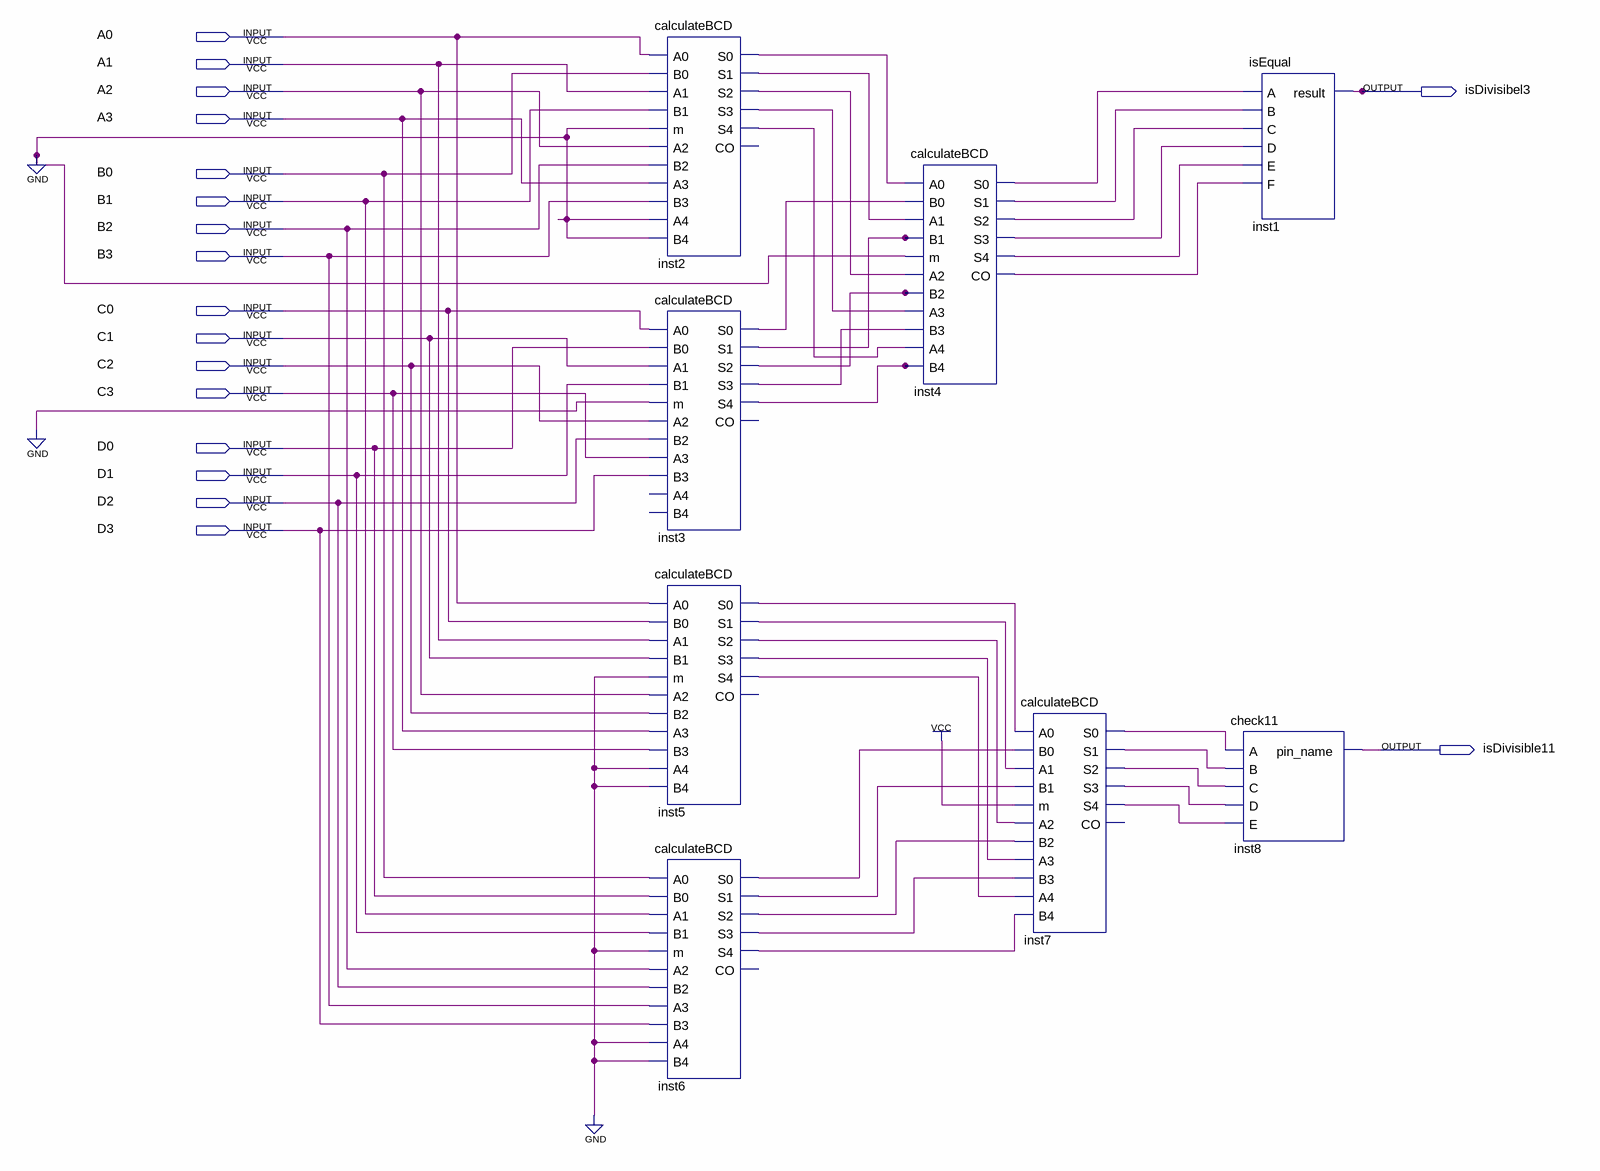
[diagram p0: schematic sheet]
// Quartus schematic main.bdf as structural Verilog: 8 symbols, 18 pins
module main (
  input  A0,
  input  A1,
  input  A2,
  input  A3,
  input  B0,
  input  B1,
  input  B2,
  input  B3,
  input  C0,
  input  C1,
  input  C2,
  input  C3,
  input  D0,
  input  D1,
  input  D2,
  input  D3,
  output isDivisibel3,
  output isDivisible11
);

  wire inst2_s0, inst2_s1, inst2_s2, inst2_s3, inst2_s4, inst3_s0, inst3_s1, inst3_s2, inst3_s3, inst3_s4,
       inst4_co, inst4_s0, inst4_s1, inst4_s2, inst4_s3, inst4_s4, inst5_s0, inst5_s1, inst5_s2, inst5_s3,
       inst5_s4, inst6_s0, inst6_s1, inst6_s2, inst6_s3, inst6_s4, inst7_s0, inst7_s1, inst7_s2, inst7_s3,
       inst7_s4;

  calculateBCD inst2 (
    .A0(A0), .B0(B0), .A1(A1), .B1(B1), .m(1'b0), .A2(A2), .B2(B2), .A3(A3), .B3(B3), .A4(1'b0), .B4(1'b0),
    .S0(inst2_s0), .S1(inst2_s1), .S2(inst2_s2), .S3(inst2_s3), .S4(inst2_s4));  // open: CO
  calculateBCD inst3 (
    .A0(C0), .B0(D0), .A1(C1), .B1(D1), .m(1'b0), .A2(C2), .B2(D2), .A3(C3), .B3(D3), .S0(inst3_s0),
    .S1(inst3_s1), .S2(inst3_s2), .S3(inst3_s3), .S4(inst3_s4));  // open: A4, B4, CO
  calculateBCD inst5 (
    .A0(A0), .B0(C0), .A1(A1), .B1(C1), .m(1'b0), .A2(A2), .B2(C2), .A3(A3), .B3(C3), .A4(1'b0), .B4(1'b0),
    .S0(inst5_s0), .S1(inst5_s1), .S2(inst5_s2), .S3(inst5_s3), .S4(inst5_s4));  // open: CO
  calculateBCD inst6 (
    .A0(B0), .B0(D0), .A1(B1), .B1(D1), .m(1'b0), .A2(B2), .B2(D2), .A3(B3), .B3(D3), .A4(1'b0), .B4(1'b0),
    .S0(inst6_s0), .S1(inst6_s1), .S2(inst6_s2), .S3(inst6_s3), .S4(inst6_s4));  // open: CO
  calculateBCD inst4 (
    .A0(inst2_s0), .B0(inst3_s0), .A1(inst2_s1), .B1(inst3_s1), .m(1'b0), .A2(inst2_s2), .B2(inst3_s2),
    .A3(inst2_s3), .B3(inst3_s3), .A4(inst2_s4), .B4(inst3_s4), .S0(inst4_s0), .S1(inst4_s1), .S2(inst4_s2),
    .S3(inst4_s3), .S4(inst4_s4), .CO(inst4_co));
  calculateBCD inst7 (
    .A0(inst5_s0), .B0(inst6_s0), .A1(inst5_s1), .B1(inst6_s1), .m(1'b1), .A2(inst5_s2), .B2(inst6_s2),
    .A3(inst5_s3), .B3(inst6_s3), .A4(inst5_s4), .B4(inst6_s4), .S0(inst7_s0), .S1(inst7_s1), .S2(inst7_s2),
    .S3(inst7_s3), .S4(inst7_s4));  // open: CO
  isEqual inst1 (
    .A(inst4_s0), .B(inst4_s1), .C(inst4_s2), .D(inst4_s3), .E(inst4_s4), .F(inst4_co), .result(isDivisibel3));
  check11 inst8 (.A(inst7_s0), .B(inst7_s1), .C(inst7_s2), .D(inst7_s3), .E(inst7_s4), .pin_name(isDivisible11));
endmodule
